# Altium schematic sheet Matrix.SchDoc
size 431 x 279 mm; SheetNumber: 2; SheetTotal: 2
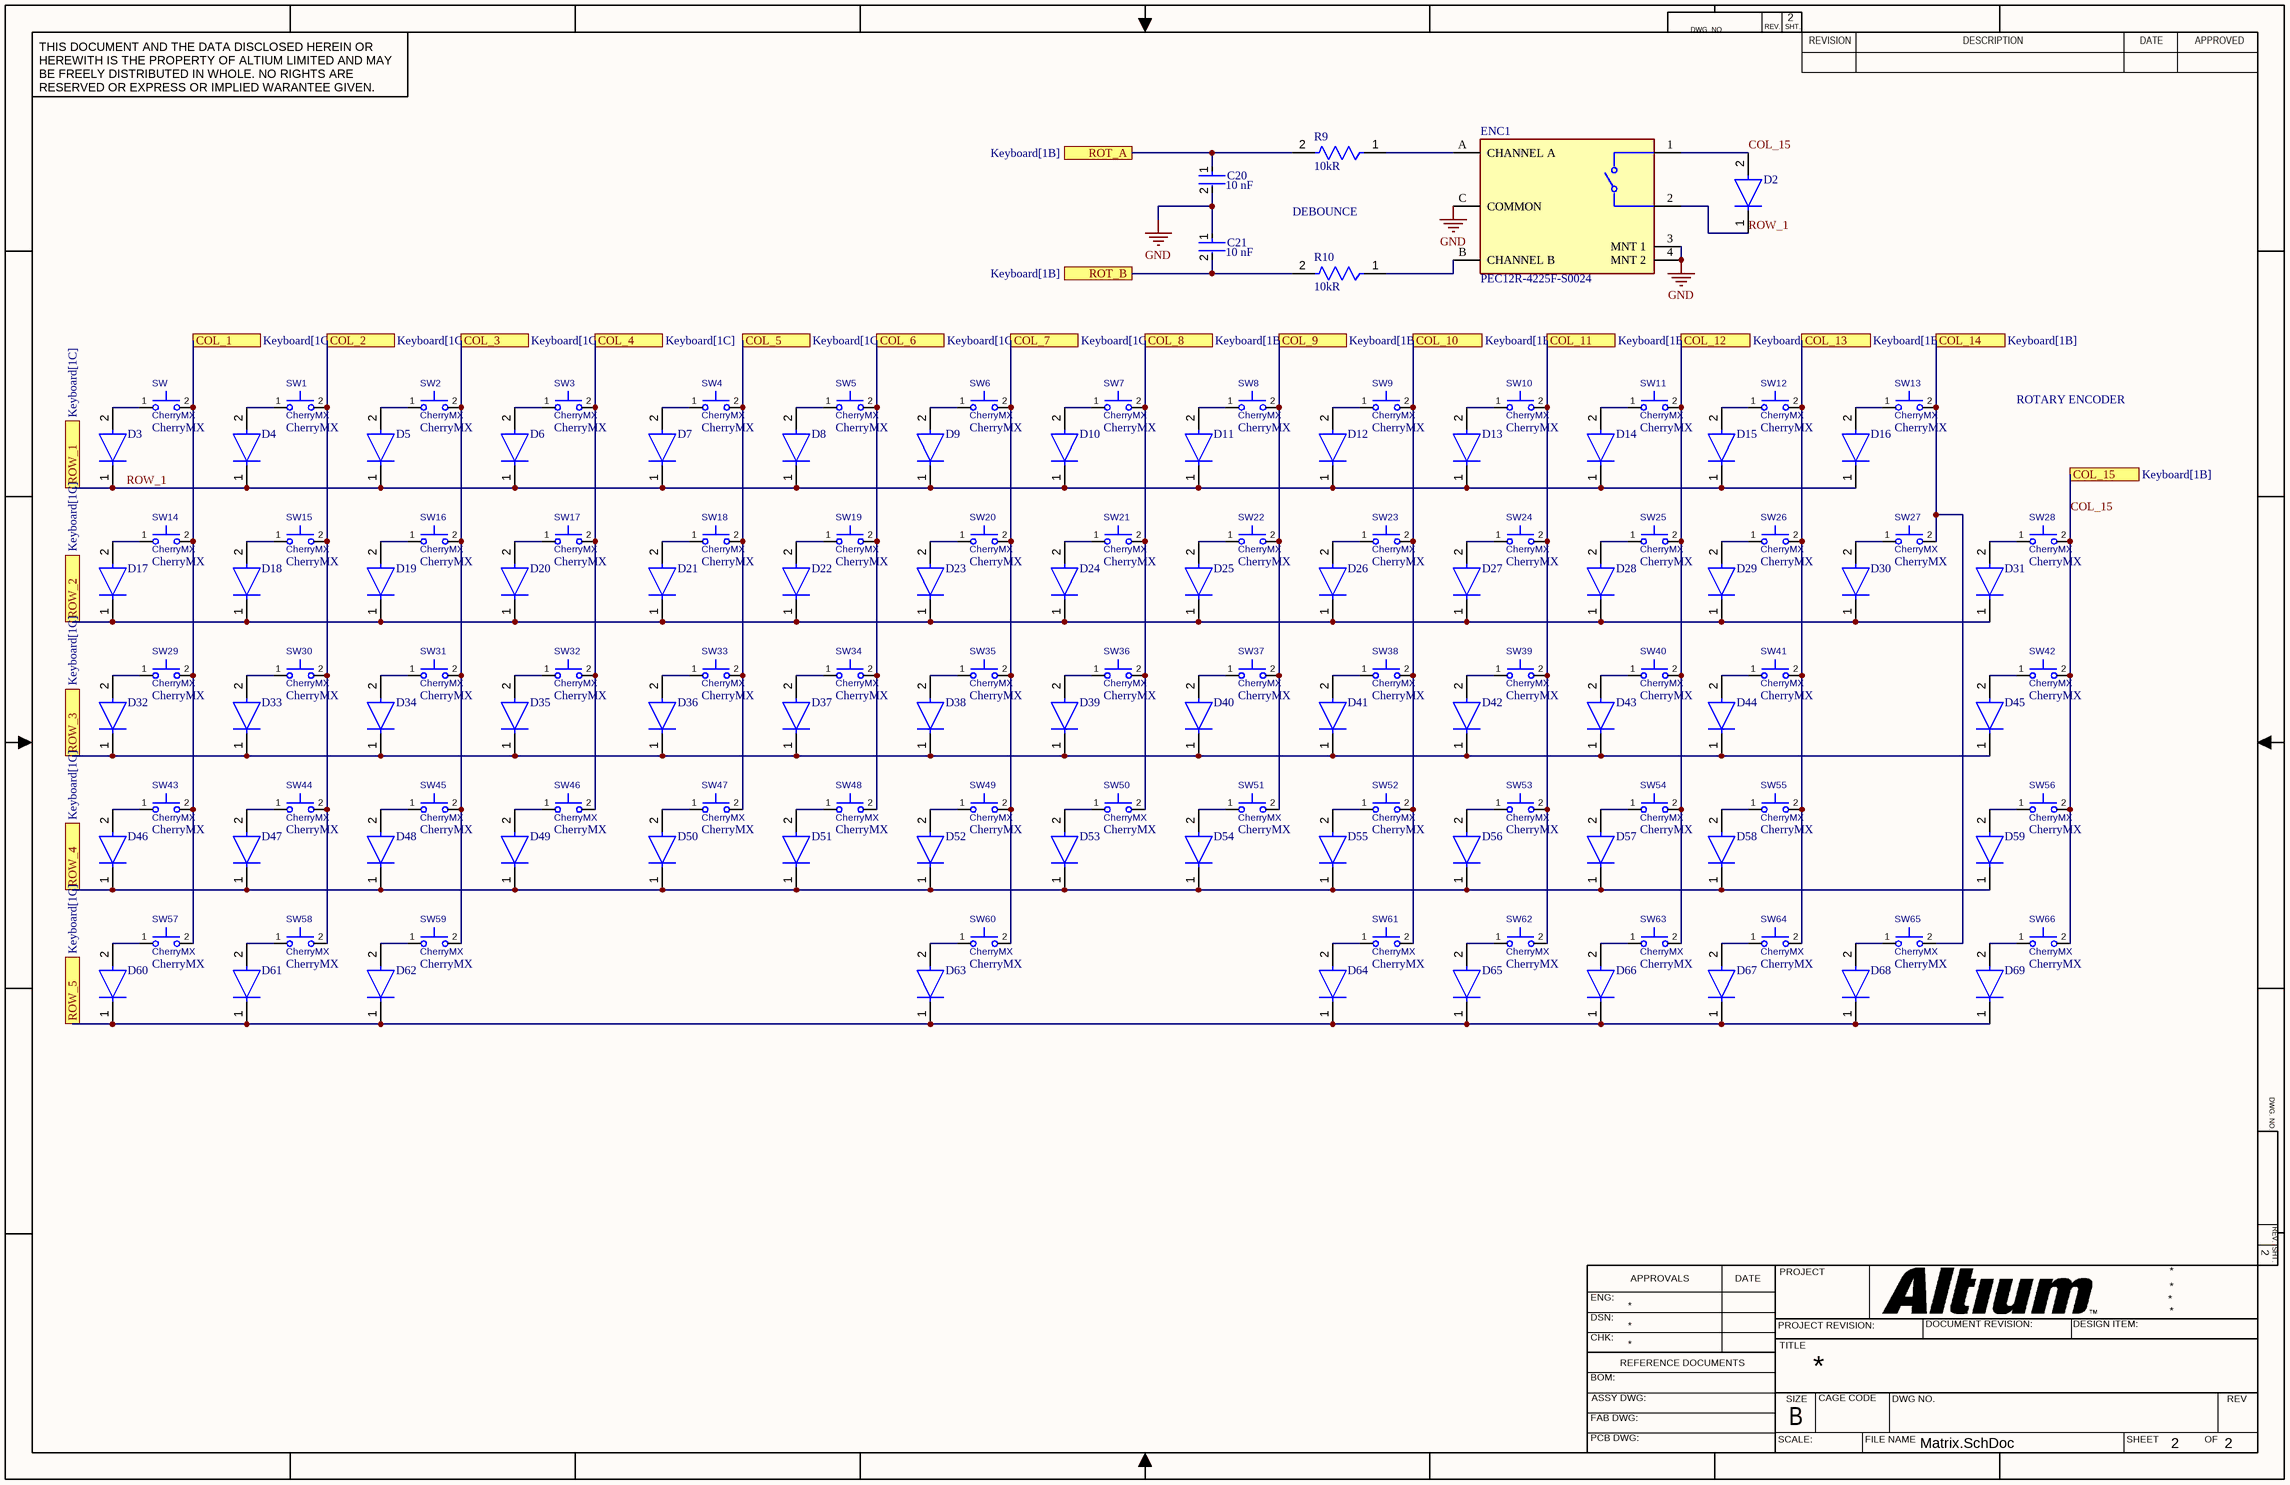
[diagram p0: Matrix.SchDoc]

## Parts
C20  Capacitance: 10 nF  [FP-CC0603-DA-MFG]  (hidden comment: CC0603KRX7R9BB103)
C21  Capacitance: 10 nF  [FP-CC0603-DA-MFG]  (hidden comment: CC0603KRX7R9BB103)
D2  1N4148W-TP  [FP-SOD-123-IPC_A]  (value not drawn)
D3  1N4148W-TP  [FP-SOD-123-IPC_A]  (value not drawn)
D4  1N4148W-TP  [FP-SOD-123-IPC_A]  (value not drawn)
D5  1N4148W-TP  [FP-SOD-123-IPC_A]  (value not drawn)
D6  1N4148W-TP  [FP-SOD-123-IPC_A]  (value not drawn)
D7  1N4148W-TP  [FP-SOD-123-IPC_A]  (value not drawn)
D8  1N4148W-TP  [FP-SOD-123-IPC_A]  (value not drawn)
D9  1N4148W-TP  [FP-SOD-123-IPC_A]  (value not drawn)
D10  1N4148W-TP  [FP-SOD-123-IPC_A]  (value not drawn)
D11  1N4148W-TP  [FP-SOD-123-IPC_A]  (value not drawn)
D12  1N4148W-TP  [FP-SOD-123-IPC_A]  (value not drawn)
D13  1N4148W-TP  [FP-SOD-123-IPC_A]  (value not drawn)
D14  1N4148W-TP  [FP-SOD-123-IPC_A]  (value not drawn)
D15  1N4148W-TP  [FP-SOD-123-IPC_A]  (value not drawn)
D16  1N4148W-TP  [FP-SOD-123-IPC_A]  (value not drawn)
D17  1N4148W-TP  [FP-SOD-123-IPC_A]  (value not drawn)
D18  1N4148W-TP  [FP-SOD-123-IPC_A]  (value not drawn)
D19  1N4148W-TP  [FP-SOD-123-IPC_A]  (value not drawn)
D20  1N4148W-TP  [FP-SOD-123-IPC_A]  (value not drawn)
D21  1N4148W-TP  [FP-SOD-123-IPC_A]  (value not drawn)
D22  1N4148W-TP  [FP-SOD-123-IPC_A]  (value not drawn)
D23  1N4148W-TP  [FP-SOD-123-IPC_A]  (value not drawn)
D24  1N4148W-TP  [FP-SOD-123-IPC_A]  (value not drawn)
D25  1N4148W-TP  [FP-SOD-123-IPC_A]  (value not drawn)
D26  1N4148W-TP  [FP-SOD-123-IPC_A]  (value not drawn)
D27  1N4148W-TP  [FP-SOD-123-IPC_A]  (value not drawn)
D28  1N4148W-TP  [FP-SOD-123-IPC_A]  (value not drawn)
D29  1N4148W-TP  [FP-SOD-123-IPC_A]  (value not drawn)
D30  1N4148W-TP  [FP-SOD-123-IPC_A]  (value not drawn)
D31  1N4148W-TP  [FP-SOD-123-IPC_A]  (value not drawn)
D32  1N4148W-TP  [FP-SOD-123-IPC_A]  (value not drawn)
D33  1N4148W-TP  [FP-SOD-123-IPC_A]  (value not drawn)
D34  1N4148W-TP  [FP-SOD-123-IPC_A]  (value not drawn)
D35  1N4148W-TP  [FP-SOD-123-IPC_A]  (value not drawn)
D36  1N4148W-TP  [FP-SOD-123-IPC_A]  (value not drawn)
D37  1N4148W-TP  [FP-SOD-123-IPC_A]  (value not drawn)
D38  1N4148W-TP  [FP-SOD-123-IPC_A]  (value not drawn)
D39  1N4148W-TP  [FP-SOD-123-IPC_A]  (value not drawn)
D40  1N4148W-TP  [FP-SOD-123-IPC_A]  (value not drawn)
D41  1N4148W-TP  [FP-SOD-123-IPC_A]  (value not drawn)
D42  1N4148W-TP  [FP-SOD-123-IPC_A]  (value not drawn)
D43  1N4148W-TP  [FP-SOD-123-IPC_A]  (value not drawn)
D44  1N4148W-TP  [FP-SOD-123-IPC_A]  (value not drawn)
D45  1N4148W-TP  [FP-SOD-123-IPC_A]  (value not drawn)
D46  1N4148W-TP  [FP-SOD-123-IPC_A]  (value not drawn)
D47  1N4148W-TP  [FP-SOD-123-IPC_A]  (value not drawn)
D48  1N4148W-TP  [FP-SOD-123-IPC_A]  (value not drawn)
D49  1N4148W-TP  [FP-SOD-123-IPC_A]  (value not drawn)
D50  1N4148W-TP  [FP-SOD-123-IPC_A]  (value not drawn)
D51  1N4148W-TP  [FP-SOD-123-IPC_A]  (value not drawn)
D52  1N4148W-TP  [FP-SOD-123-IPC_A]  (value not drawn)
D53  1N4148W-TP  [FP-SOD-123-IPC_A]  (value not drawn)
D54  1N4148W-TP  [FP-SOD-123-IPC_A]  (value not drawn)
D55  1N4148W-TP  [FP-SOD-123-IPC_A]  (value not drawn)
D56  1N4148W-TP  [FP-SOD-123-IPC_A]  (value not drawn)
D57  1N4148W-TP  [FP-SOD-123-IPC_A]  (value not drawn)
D58  1N4148W-TP  [FP-SOD-123-IPC_A]  (value not drawn)
D59  1N4148W-TP  [FP-SOD-123-IPC_A]  (value not drawn)
D60  1N4148W-TP  [FP-SOD-123-IPC_A]  (value not drawn)
D61  1N4148W-TP  [FP-SOD-123-IPC_A]  (value not drawn)
D62  1N4148W-TP  [FP-SOD-123-IPC_A]  (value not drawn)
D63  1N4148W-TP  [FP-SOD-123-IPC_A]  (value not drawn)
D64  1N4148W-TP  [FP-SOD-123-IPC_A]  (value not drawn)
D65  1N4148W-TP  [FP-SOD-123-IPC_A]  (value not drawn)
D66  1N4148W-TP  [FP-SOD-123-IPC_A]  (value not drawn)
D67  1N4148W-TP  [FP-SOD-123-IPC_A]  (value not drawn)
D68  1N4148W-TP  [FP-SOD-123-IPC_A]  (value not drawn)
D69  1N4148W-TP  [FP-SOD-123-IPC_A]  (value not drawn)
ENC1  PEC12R-4225F-S0024  [FP-PEC12R-4225F-S0024-MFG]
R9  Resistance: 10kR  [FP-RC0402-0_4-IPC_C]  (hidden comment: RC0402JR-0710KL)
R10  Resistance: 10kR  [FP-RC0402-0_4-IPC_C]  (hidden comment: RC0402JR-0710KL)
SW  CherryMX  [CherryMX-Footprint-1]
SW1  CherryMX  [CherryMX-Footprint-1]
SW2  CherryMX  [CherryMX-Footprint-1]
SW3  CherryMX  [CherryMX-Footprint-1]
SW4  CherryMX  [CherryMX-Footprint-1]
SW5  CherryMX  [CherryMX-Footprint-1]
SW6  CherryMX  [CherryMX-Footprint-1]
SW7  CherryMX  [CherryMX-Footprint-1]
SW8  CherryMX  [CherryMX-Footprint-1]
SW9  CherryMX  [CherryMX-Footprint-1]
SW10  CherryMX  [CherryMX-Footprint-1]
SW11  CherryMX  [CherryMX-Footprint-1]
SW12  CherryMX  [CherryMX-Footprint-1]
SW13  CherryMX  [CherryMX-Footprint-1]
SW14  CherryMX  [CherryMX-Footprint-1]
SW15  CherryMX  [CherryMX-Footprint-1]
SW16  CherryMX  [CherryMX-Footprint-1]
SW17  CherryMX  [CherryMX-Footprint-1]
SW18  CherryMX  [CherryMX-Footprint-1]
SW19  CherryMX  [CherryMX-Footprint-1]
SW20  CherryMX  [CherryMX-Footprint-1]
SW21  CherryMX  [CherryMX-Footprint-1]
SW22  CherryMX  [CherryMX-Footprint-1]
SW23  CherryMX  [CherryMX-Footprint-1]
SW24  CherryMX  [CherryMX-Footprint-1]
SW25  CherryMX  [CherryMX-Footprint-1]
SW26  CherryMX  [CherryMX-Footprint-1]
SW27  CherryMX  [CherryMX-Footprint-1]
SW28  CherryMX  [CherryMX-Footprint-1]
SW29  CherryMX  [CherryMX-Footprint-1]
SW30  CherryMX  [CherryMX-Footprint-1]
SW31  CherryMX  [CherryMX-Footprint-1]
SW32  CherryMX  [CherryMX-Footprint-1]
SW33  CherryMX  [CherryMX-Footprint-1]
SW34  CherryMX  [CherryMX-Footprint-1]
SW35  CherryMX  [CherryMX-Footprint-1]
SW36  CherryMX  [CherryMX-Footprint-1]
SW37  CherryMX  [CherryMX-Footprint-1]
SW38  CherryMX  [CherryMX-Footprint-1]
SW39  CherryMX  [CherryMX-Footprint-1]
SW40  CherryMX  [CherryMX-Footprint-1]
SW41  CherryMX  [CherryMX-Footprint-1]
SW42  CherryMX  [CherryMX-Footprint-1]
SW43  CherryMX  [CherryMX-Footprint-1]
SW44  CherryMX  [CherryMX-Footprint-1]
SW45  CherryMX  [CherryMX-Footprint-1]
SW46  CherryMX  [CherryMX-Footprint-1]
SW47  CherryMX  [CherryMX-Footprint-1]
SW48  CherryMX  [CherryMX-Footprint-1]
SW49  CherryMX  [CherryMX-Footprint-1]
SW50  CherryMX  [CherryMX-Footprint-1]
SW51  CherryMX  [CherryMX-Footprint-1]
SW52  CherryMX  [CherryMX-Footprint-1]
SW53  CherryMX  [CherryMX-Footprint-1]
SW54  CherryMX  [CherryMX-Footprint-1]
SW55  CherryMX  [CherryMX-Footprint-1]
SW56  CherryMX  [CherryMX-Footprint-1]
SW57  CherryMX  [CherryMX-Footprint-1]
SW58  CherryMX  [CherryMX-Footprint-1]
SW59  CherryMX  [CherryMX-Footprint-1]
SW60  CherryMX  [CherryMX-Footprint-1]
SW61  CherryMX  [CherryMX-Footprint-1]
SW62  CherryMX  [CherryMX-Footprint-1]
SW63  CherryMX  [CherryMX-Footprint-1]
SW64  CherryMX  [CherryMX-Footprint-1]
SW65  CherryMX  [CherryMX-Footprint-1]
SW66  CherryMX  [CherryMX-Footprint-1]

## Ports
COL_1 (see Keyboard[1C]), COL_2 (see Keyboard[1C]), COL_3 (see Keyboard[1C]), COL_4 (see Keyboard[1C]), COL_5 (see Keyboard[1C]), COL_6 (see Keyboard[1C]), COL_7 (see Keyboard[1C]), COL_8 (see Keyboard[1B]), COL_9 (see Keyboard[1B]), COL_10 (see Keyboard[1B]), COL_11 (see Keyboard[1B]), COL_12 (see Keyboard[1B]), COL_13 (see Keyboard[1B]), COL_14 (see Keyboard[1B]), COL_15 (see Keyboard[1B]), ROT_A (see Keyboard[1B]), ROT_B (see Keyboard[1B]), ROW_1 (see Keyboard[1C]), ROW_2 (see Keyboard[1C]), ROW_3 (see Keyboard[1C]), ROW_4 (see Keyboard[1C]), ROW_5 (see Keyboard[1C])

## Nets
GND: C20.2 C21.1 ENC1.3(MNT_1) ENC1.4(MNT_2) ENC1.C(COMMON)
COL_1: SW.2 SW14.2 SW29.2 SW43.2 SW57.2 ; port COL_1
COL_2: SW1.2 SW15.2 SW30.2 SW44.2 SW58.2 ; port COL_2
COL_3: SW2.2 SW16.2 SW31.2 SW45.2 SW59.2 ; port COL_3
COL_4: SW3.2 SW17.2 SW32.2 SW46.2 ; port COL_4
COL_5: SW4.2 SW18.2 SW33.2 SW47.2 ; port COL_5
COL_6: SW5.2 SW19.2 SW34.2 SW48.2 ; port COL_6
COL_7: SW6.2 SW20.2 SW35.2 SW49.2 SW60.2 ; port COL_7
COL_8: SW7.2 SW21.2 SW36.2 SW50.2 ; port COL_8
COL_9: SW8.2 SW22.2 SW37.2 SW51.2 ; port COL_9
COL_10: SW9.2 SW23.2 SW38.2 SW52.2 SW61.2 ; port COL_10
COL_11: SW10.2 SW24.2 SW39.2 SW53.2 SW62.2 ; port COL_11
COL_12: SW11.2 SW25.2 SW40.2 SW54.2 SW63.2 ; port COL_12
COL_13: SW12.2 SW26.2 SW41.2 SW55.2 SW64.2 ; port COL_13
COL_14: SW13.2 SW27.2 SW65.2 ; port COL_14
COL_15: D2.2(A) ENC1.1 SW28.2 SW42.2 SW56.2 SW66.2 ; port COL_15
ROT_A: C20.1 R9.2 ; port ROT_A
ROT_B: C21.2 R10.2 ; port ROT_B
ROW_1: D2.1(C) D3.1(C) D4.1(C) D5.1(C) D6.1(C) D7.1(C) D8.1(C) D9.1(C) D10.1(C) D11.1(C) D12.1(C) D13.1(C) D14.1(C) D15.1(C) D16.1(C) ENC1.2 ; port ROW_1
ROW_2: D17.1(C) D18.1(C) D19.1(C) D20.1(C) D21.1(C) D22.1(C) D23.1(C) D24.1(C) D25.1(C) D26.1(C) D27.1(C) D28.1(C) D29.1(C) D30.1(C) D31.1(C) ; port ROW_2
ROW_3: D32.1(C) D33.1(C) D34.1(C) D35.1(C) D36.1(C) D37.1(C) D38.1(C) D39.1(C) D40.1(C) D41.1(C) D42.1(C) D43.1(C) D44.1(C) D45.1(C) ; port ROW_3
ROW_4: D46.1(C) D47.1(C) D48.1(C) D49.1(C) D50.1(C) D51.1(C) D52.1(C) D53.1(C) D54.1(C) D55.1(C) D56.1(C) D57.1(C) D58.1(C) D59.1(C) ; port ROW_4
ROW_5: D60.1(C) D61.1(C) D62.1(C) D63.1(C) D64.1(C) D65.1(C) D66.1(C) D67.1(C) D68.1(C) D69.1(C) ; port ROW_5
NetD3_2: D3.2(A) SW.1
NetD4_2: D4.2(A) SW1.1
NetD5_2: D5.2(A) SW2.1
NetD6_2: D6.2(A) SW3.1
NetD7_2: D7.2(A) SW4.1
NetD8_2: D8.2(A) SW5.1
NetD9_2: D9.2(A) SW6.1
NetD10_2: D10.2(A) SW7.1
NetD11_2: D11.2(A) SW8.1
NetD12_2: D12.2(A) SW9.1
NetD13_2: D13.2(A) SW10.1
NetD14_2: D14.2(A) SW11.1
NetD15_2: D15.2(A) SW12.1
NetD16_2: D16.2(A) SW13.1
NetD17_2: D17.2(A) SW14.1
NetD18_2: D18.2(A) SW15.1
NetD19_2: D19.2(A) SW16.1
NetD20_2: D20.2(A) SW17.1
NetD21_2: D21.2(A) SW18.1
NetD22_2: D22.2(A) SW19.1
NetD23_2: D23.2(A) SW20.1
NetD24_2: D24.2(A) SW21.1
NetD25_2: D25.2(A) SW22.1
NetD26_2: D26.2(A) SW23.1
NetD27_2: D27.2(A) SW24.1
NetD28_2: D28.2(A) SW25.1
NetD29_2: D29.2(A) SW26.1
NetD30_2: D30.2(A) SW27.1
NetD31_2: D31.2(A) SW28.1
NetD32_2: D32.2(A) SW29.1
NetD33_2: D33.2(A) SW30.1
NetD34_2: D34.2(A) SW31.1
NetD35_2: D35.2(A) SW32.1
NetD36_2: D36.2(A) SW33.1
NetD37_2: D37.2(A) SW34.1
NetD38_2: D38.2(A) SW35.1
NetD39_2: D39.2(A) SW36.1
NetD40_2: D40.2(A) SW37.1
NetD41_2: D41.2(A) SW38.1
NetD42_2: D42.2(A) SW39.1
NetD43_2: D43.2(A) SW40.1
NetD44_2: D44.2(A) SW41.1
NetD45_2: D45.2(A) SW42.1
NetD46_2: D46.2(A) SW43.1
NetD47_2: D47.2(A) SW44.1
NetD48_2: D48.2(A) SW45.1
NetD49_2: D49.2(A) SW46.1
NetD50_2: D50.2(A) SW47.1
NetD51_2: D51.2(A) SW48.1
NetD52_2: D52.2(A) SW49.1
NetD53_2: D53.2(A) SW50.1
NetD54_2: D54.2(A) SW51.1
NetD55_2: D55.2(A) SW52.1
NetD56_2: D56.2(A) SW53.1
NetD57_2: D57.2(A) SW54.1
NetD58_2: D58.2(A) SW55.1
NetD59_2: D59.2(A) SW56.1
NetD60_2: D60.2(A) SW57.1
NetD61_2: D61.2(A) SW58.1
NetD62_2: D62.2(A) SW59.1
NetD63_2: D63.2(A) SW60.1
NetD64_2: D64.2(A) SW61.1
NetD65_2: D65.2(A) SW62.1
NetD66_2: D66.2(A) SW63.1
NetD67_2: D67.2(A) SW64.1
NetD68_2: D68.2(A) SW65.1
NetD69_2: D69.2(A) SW66.1
NetENC1_A: ENC1.A(CHANNEL_A) R9.1
NetENC1_B: ENC1.B(CHANNEL_B) R10.1

## Notes on the sheet
- DEBOUNCE
- ROTARY ENCODER
- DWG. NO.
- REV.
- SHT.
- THIS DOCUMENT AND THE DATA DISCLOSED HEREIN OR HEREWITH IS THE PROPERTY OF ALTIUM LIMITED AND MAY BE FREELY DISTRIBUTED IN WHOLE. NO RIGHTS ARE RESERVED OR EXPRESS OR IMPLIED WARANTEE GIVEN.
- REVISION
- DESCRIPTION
- DATE
- APPROVED
- ENG:
- APPROVALS
- PROJECT
- DSN:
- CHK:
- REFERENCE DOCUMENTS
- PROJECT REVISION:
- TITLE
- DOCUMENT REVISION:
- DESIGN ITEM:
- BOM:
- FAB DWG:
- PCB DWG:
- ASSY DWG:
- SCALE:
- SIZE
- B
- CAGE CODE
- FILE NAME
- DWG NO.
- SHEET
- OF
- REV

## Library data of the parts
C20 C21 = CMP-2100-03600-2: CAP CER 10000PF 50V X7R 0603; Manufacturer: YAGEO; Tolerance: 0.1; Material: Ceramic; Temperature Coefficient: 15%; Value: 10 nF; Description: CC0603 10 nF X7R 10.00% 50 V; Mouser Description: Multilayer Ceramic Capacitor, CC Series, 0.01 - F, - 10%, X7R, 50 V, 0603 [1608 Metric]; Digikey Description: CAP CER 10000PF 50V X7R 0603; Height: 0.9mm; Category: Cap; Temperature Characteristic: X7R; Footprint Url: http://www.yageo.com/exep/pages/download/literatures/UPY-C_GEN_24.pdf; Lead Free: Yes; Voltage Rating: 50 V; Manufacturer Part Number: CC0603KRX7R9BB103; Temperature: -55°C to +125°C; Device Class L3: Ceramic Capacitors; ComponentLink2Description: Datasheet; Voltage: 50 V; Package: CC0603-DA; Octopart: https://octopart.com/cc0603krx7r9bb103-yageo-192938; Automotive: No; Temperature Range High: +125°C; Temperature Range Low: -55°C; RoHS: TRUE; Device Class L1: Passive Components; ComponentLink2URL: http://www.yageo.com/documents/recent/UPY-GPHC_X7R_6.3V-to-50V_18.pdf; Device Class L2: Capacitors
D2-D69 = CMP-2000-04993-2: DIODE GEN PURP 100V 150MA SOD123; Max Reverse Leakage Current: 5uA; Max Surge Current: 2A; Reverse Recovery Time: 4ns; Polarity: Standard; Capacitance: 4pF; Max Forward Surge Current (Ifsm): 1A; Element Configuration: Single; Power Dissipation: 400mW; Forward Voltage: 1V; Radiation Hardening: No; Lead Free: Lead Free; Max Reverse Voltage (DC): 100V; Current Rating: 150mA; Forward Current: 150mA; Packaging: Tape and Reel; Number of Pins: 2; Package Quantity: 3000; Max Operating Temperature: 150°C; Min Operating Temperature: -65°C; Average Rectified Current: 150mA; Recovery Time: 4ns; Output Current: 150mA; Peak Non-Repetitive Surge Current: 2A; Width: 1.8mm; Voltage Rating (DC): 100V; Height: 1.2mm; Max Repetitive Reverse Voltage (Vrrm): 100V; Mount: Surface Mount; Length: 2.85mm
ENC1 = CMP-07421-000041-1: ROTARY ENCODER MECHANICAL 24PPR; Built in Switch: Yes; Hole Diameter: 1mm; Number of Channels: 2; Pulses per Revolution: 24; Output Type: Quadrature; Height: 13.4mm; Mount: Through Hole; RoHS Compliant: Yes; Orientation: Vertical; Length: 13.4mm; Encoder Type: Mechanical; Termination: PC Pin; Series: PEC12R; Min Operating Temperature: -30°C; Detent: Yes; REACH SVHC: No SVHC; Package Quantity: 75; Max Operating Temperature: 70°C; Packaging: Bulk; Width: 12.5mm
R9 R10 = CMP-2002-07915-3: RES 10K OHM 5% 1/16W 0402; Max Power Dissipation: 63mW; Temperature Coefficient: 100ppm/°C; Power Rating: 62.5mW; Voltage Rating: 50V; Size Code: 0402; Resistance Tolerance: 5%; Packaging: Tape and Reel; Case Code (Metric): 1005; Lead Free: Lead Free; Resistor Type: Thick Film; Min Operating Temperature: -55°C; Military Standard: Not; Depth: 0.5mm; Series: RC; Case/Package: 0402; Construction: Rectangular; Number of Terminations: 2; Package Quantity: 1; Termination: SMD/SMT; Length: 0.039inch; Case Code (Imperial): 0402; Height: 0.016inch; Features: Moisture Resistant; RoHS Compliant: Yes; Max Operating Temperature: 155°C; Tolerance: 5%; Width: 0.02inch
SW SW1-SW66 = CMP-037-000000-5: Cherry Switch 1U; Value: CherryMX; Design Item ID: CherryMX; Source: CherryMX.SchLib